# Altium schematic sheet SW_RESET_SPNO.SCHDOC: Push Button SPNO Switch
size A4; Organization: Altium Limited.; Address1: Level 3, 12a Rodborough Rd; Address2: Frenchs Forest 2086; Address3: NSW; Address4: AUSTRALIA; Revision: 6; SheetNumber: 2; SheetTotal: 64; PageSetup: Record=PageOptions|CenterHorizontal=True|CenterVertical=True|PrintScale=0.97|XCorrection=1.00|YCorrection=1.00|PrintKind=0|BorderSize=5000000|LeftOffset=0|BottomOffset=0|Orientation=2|PaperLength=1000|PaperWidth=1000|Scale=100|PaperSource=7|PrintQuality=-4|MediaType=1|DitherType=10|PaperKind=A4|PrintScaleMode=1
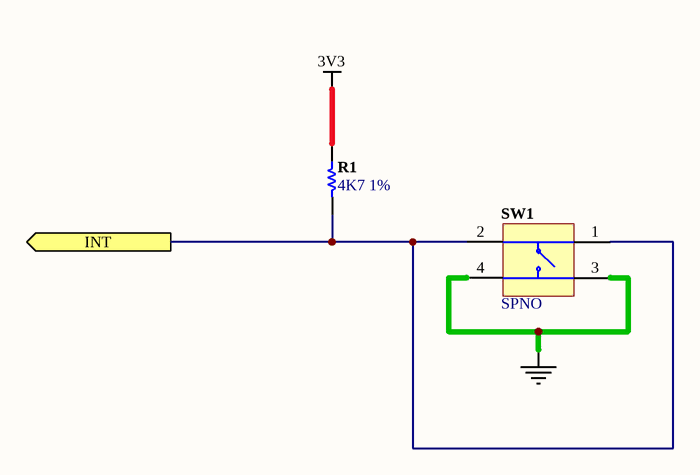
[diagram p0: SW_RESET_SPNO.SCHDOC]

## Parts
R1  4K7 1%  [RESC1005-STAR]
SW1  SPNO  [SW_DTSM-61NT/R]

## Ports
INT (out)

## Nets
3V3: R1.1
GND: SW1.3 SW1.4
INT: R1.2 SW1.1 SW1.2 ; port INT

## Notes on the sheet
- Sheet Title
- Project Title
- Size:
- Date:
- A4
- Assy:
- Time:
- Sheet
- Revision:
- of
- File:

## Library data of the parts
R1 = D-100-0088: Resistor, 4K7 1% 0402 (1005); Power Rating: 63 mW; Resistance: 4.7 K; Category: Resistor; Mounting Technology: Surface Mount; Status: Production; Tolerance: 1 %
SW1 = D-301-0001: Switch, SPNO Push Button SMD; Rated Voltage: mV; Switch Type: SPDT; Category: Switch; Mounting Technology: Surface Mount; Status: Production